# Altium schematic sheet USB_OTG_FS.SchDoc: USB_OTG_FS
size A4; Author: P.A.; CompanyName: STMicroelectronics; Organization: Microcontrollers Division; Address1: 12, Rue Jules HOROWITZ; Address2: 38019 Grenoble; Address3: FRANCE; DocumentNumber: MB1261; Revision: B.01; SheetNumber: 8; SheetTotal: 15; Project: STM32L496G-DISCO
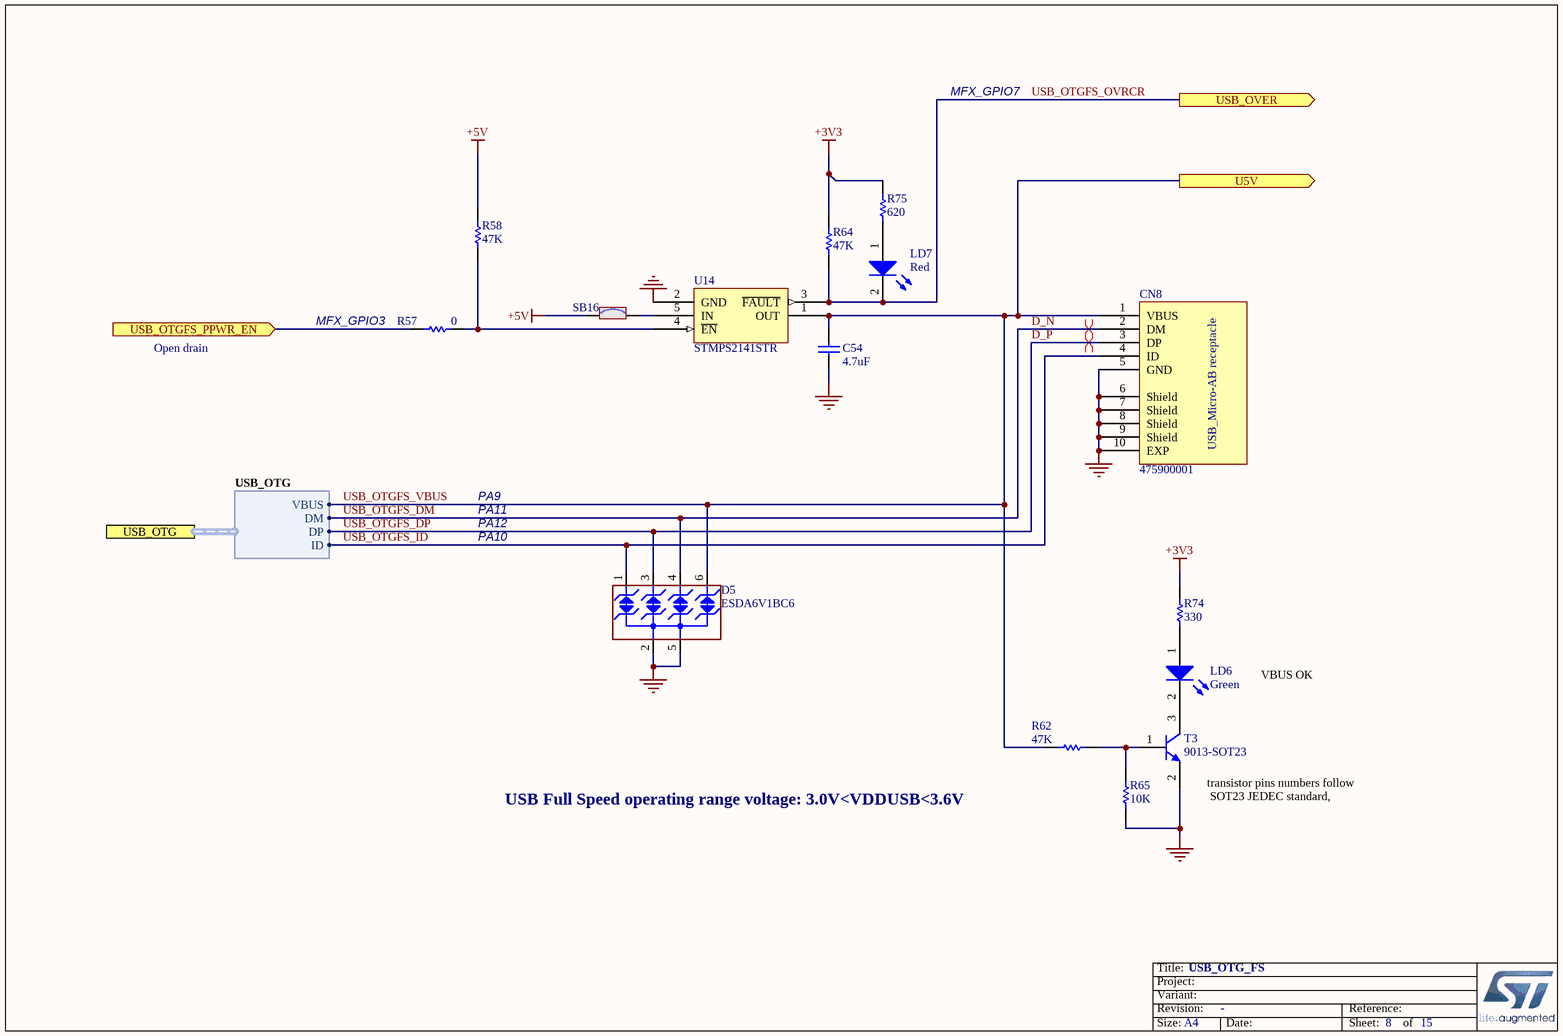
[diagram p0: USB_OTG_FS.SchDoc]

## Parts
C54  value 4.7uF  [0603C]  (hidden comment: CC0603KRX5R7BB475)
CN8  475900001  [MOLEX_47590001]
D5  ESDA6V1BC6  [SOT23-6L]
LD6  Corlor: Green  [0603D]  (hidden comment: 19-213SY6C/S530-E2/TR8LED)
LD7  Corlor: Red  [0603D]  (hidden comment: 19-217/R6C-AL1M2VY/3T)
R57  value 0  [0603R]  (hidden comment: RC0603JR-070RL)
R58  value 47K  [0603R]  (hidden comment: RC0603JR-0747KL)
R62  value 47K  [0603R]  (hidden comment: RC0603JR-0747KL)
R64  value 47K  [0603R]  (hidden comment: RC0603JR-0747KL)
R65  value 10K  [0603R]  (hidden comment: RC0603JR-0710KL)
R74  value 330  [0603R]  (hidden comment: RC0603JR-07330RL)
R75  value 620  [0603R]  (hidden comment: RC0603JR-07620RL)
SB16  Solder Bridge ON  [SB_0603]  (value not drawn)
T3  9013-SOT23  [SOT-23]
U14  STMPS2141STR  [SOT23-5]

## Ports
U5V (out), USB_OTG (harness USB_OTG), USB_OTGFS_PPWR_EN (in), USB_OVER (out)

## Harnesses
USB_OTG: VBUS, DM, DP, ID

## Nets
+3V3: R64.1 R74.1 R75.1
+5V: R58.1 SB16.1
GND: C54.2 CN8.5(GND) CN8.6(Shield) CN8.7(Shield) CN8.8(Shield) CN8.9(Shield) CN8.10(EXP) D5.2(IO2) D5.5(IO4) R65.1 T3.2(E) U14.2(GND)
D_N: CN8.2(DM) D5.4(IO3) ; port USB_OTG.DM  [also labelled USB_OTGFS_DM]
D_P: CN8.3(DP) D5.3(GND) ; port USB_OTG.DP  [also labelled USB_OTGFS_DP]
USB_OTGFS_ID: CN8.4(ID) D5.1(IO1) ; port USB_OTG.ID
USB_OTGFS_OVRCR: LD7.2(K) R64.2 U14.3(~{FAULT}) ; port USB_OVER
USB_OTGFS_PPWR_EN: R57.2 ; port USB_OTGFS_PPWR_EN
USB_OTGFS_VBUS: C54.1 CN8.1(VBUS) D5.6(NC) R62.1 U14.1(OUT) ; port U5V, port USB_OTG.VBUS
NetLD6_1: LD6.1(A) R74.2
NetLD6_2: LD6.2(K) T3.3(C)
NetLD7_1: LD7.1(A) R75.2
NetR57_1: R57.1 R58.2 U14.4(~{EN})
NetR62_2: R62.2 R65.2 T3.1(B)
NetSB16_2: SB16.2 U14.5(IN)

## Layout directives
differential pair: D_N, D_P

## Notes on the sheet
- MFX_GPIO7
- Open drain
- (near R57) MFX_GPIO3
- PA9
- PA11
- PA10
- PA12
- VBUS OK
- USB Full Speed operating range voltage: 3.0V<VDDUSB<3.6V
- (near T3) transistor pins numbers follow
  SOT23 JEDEC standard,
- Title:
- Project:
- Size:
- Revision:
- Variant:
- A4
- -
- Date:
- Reference:
- Sheet:
- of
- (in symbol 475900001) USB_Micro-AB receptacle

## Library data of the parts
C54 = Cap: Capacitor,4.7uF,16V, X5R,10%,0603; Manuf_1: YAGEO; Ordered by: Subcon; Published: 8-Jun-2000; Revision: July-2002: Re-released for DXP Platform.; Publisher: Altium Limited; Manuf_Part_1: CC0603KRX5R7BB475
CN8 = 475900001: Manuf_1: MOLEX; Ordered by: Subcon; Silkscreen: USB_USER; ECCN_US/EU: NA; Manuf_Part_1: 475900001
D5 = ESDA6V1BC6: 4-line ESD protection; Manuf_1: STM; Manuf_Part_1: ESDA5V3L; Ref St: 9179034; Provided: ST; ECCN_US/EU: EAR99/NEC; Distrib: ST; Order: ESDA5V3L; Ordered by: STM
LD6 = LED2: LED,Green,0603; Manuf_1: Everlight; Ordered by: Subcon; ECCN_US/EU: EAR99/NEC; Published: 8-Jun-2000; Revision: July-2002: Re-released for DXP Platform.; Publisher: Altium Limited; Manuf_Part_1: 19-213SY6C/S530-E2/TR8LED
LD7 = LED2: LED, Red ,0603; Manuf_1: Everlight; Ordered by: Subcon; ECCN_US/EU: EAR99/NEC; Published: 8-Jun-2000; Revision: July-2002: Re-released for DXP Platform.; Publisher: Altium Limited; Manuf_Part_1: 19-217/R6C-AL1M2VY/3T
R57 = res1: Resistor, 0 ,0603,1%,YAGEO; Ordered by: Subcon; ECCN_US/EU: NA; Published: 8-Jun-2000; Revision: July-2002: Re-released for DXP Platform.; Publisher: Altium Limited; Manuf_1: YAGEO; Manuf_Part_1: RC0603JR-070RL
R58 R62 R64 = res1: Resistor, 47K,0603,1%,YAGEO; Ordered by: Subcon; ECCN_US/EU: NA; Published: 8-Jun-2000; Revision: July-2002: Re-released for DXP Platform.; Publisher: Altium Limited; Manuf_1: YAGEO; Manuf_Part_1: RC0603JR-0747KL
R65 = res1: Resistor, 10K,0603,1%,YAGEO; Ordered by: Subcon; ECCN_US/EU: NA; Published: 8-Jun-2000; Revision: July-2002: Re-released for DXP Platform.; Publisher: Altium Limited; Manuf_1: YAGEO; Manuf_Part_1: RC0603JR-0710KL
R74 = res1: Resistor, 330R , 0603,1%,YAGEO; Ordered by: Subcon; ECCN_US/EU: NA; Published: 8-Jun-2000; Revision: July-2002: Re-released for DXP Platform.; Publisher: Altium Limited; Manuf_1: YAGEO; Manuf_Part_1: RC0603JR-07330RL
R75 = res1: Resistor, 620R , 0603,1%,YAGEO; Ordered by: Subcon; ECCN_US/EU: NA; Published: 8-Jun-2000; Revision: July-2002: Re-released for DXP Platform.; Publisher: Altium Limited; Manuf_1: YAGEO; Manuf_Part_1: RC0603JR-07620RL
SB16 = SB_ON: Manuf_1: YAGEO; Manuf_Part_1: RC0603JR-070RL; Solder: YES; Ordered By: Subcon; Revision: July-2002: Re-released for DXP Platform.; ECCN_US/EU: N/A
T3 = NPN: NPN Bipolar Transistor; Manuf_Part_1: MMBT9013; Code - JEDEC: TO-226-AA; Ordered by: Subcon; ECCN_US/EU: EAR99/NEC; Published: 8-Jun-2000; Revision: July-2002: Re-released for DXP Platform.; Publisher: Altium Limited
U14 = STMPS2141STR: Enhanced single channel power switches; Provided: ST; ECCN_US/EU: EAR99/NEC; Ref St: 9159003; Ordered by: STM; Order: STMPS2141STR; Manuf_Part_1: STMPS2141STR; Manuf_1: ST; Distrib: ST